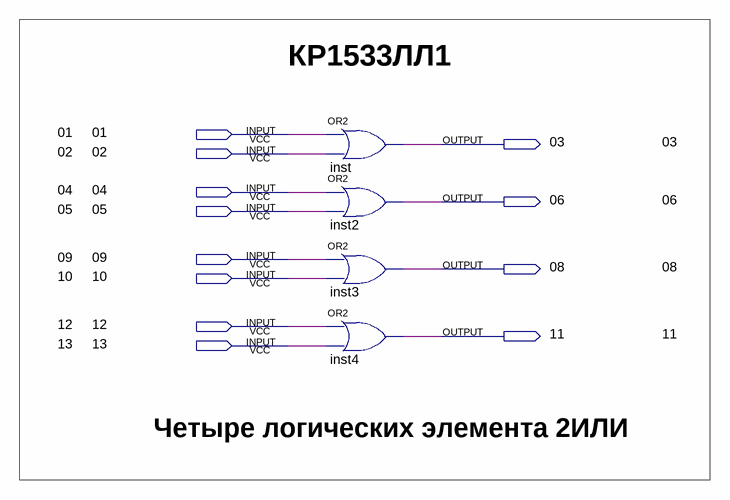
[diagram p0: schematic sheet]
// Quartus schematic KP1533LL1.bdf as structural Verilog: 4 symbols, 12 pins
module KP1533LL1 (
  input  \01 ,
  input  \02 ,
  input  \04 ,
  input  \05 ,
  input  \09 ,
  input  \10 ,
  input  \12 ,
  input  \13 ,
  output \03 ,
  output \06 ,
  output \08 ,
  output \11 
);

  or inst (\03 , \01 , \02 );
  or inst2 (\06 , \04 , \05 );
  or inst3 (\08 , \09 , \10 );
  or inst4 (\11 , \12 , \13 );

  // Notes on the sheet:
  //   КР1533ЛЛ1
  //   01
  //   03
  //   02
  //   04
  //   06
  //   05
  //   09
  //   08
  //   10
  //   12
  //   11
  //   13
  //   Четыре логических элемента 2ИЛИ
endmodule
